# Altium schematic sheet Program_Counter.SchDoc
size B; Author: E. Sims; Organization: Let's Build Rockets Inc.; SheetNumber: 2; SheetTotal: 3
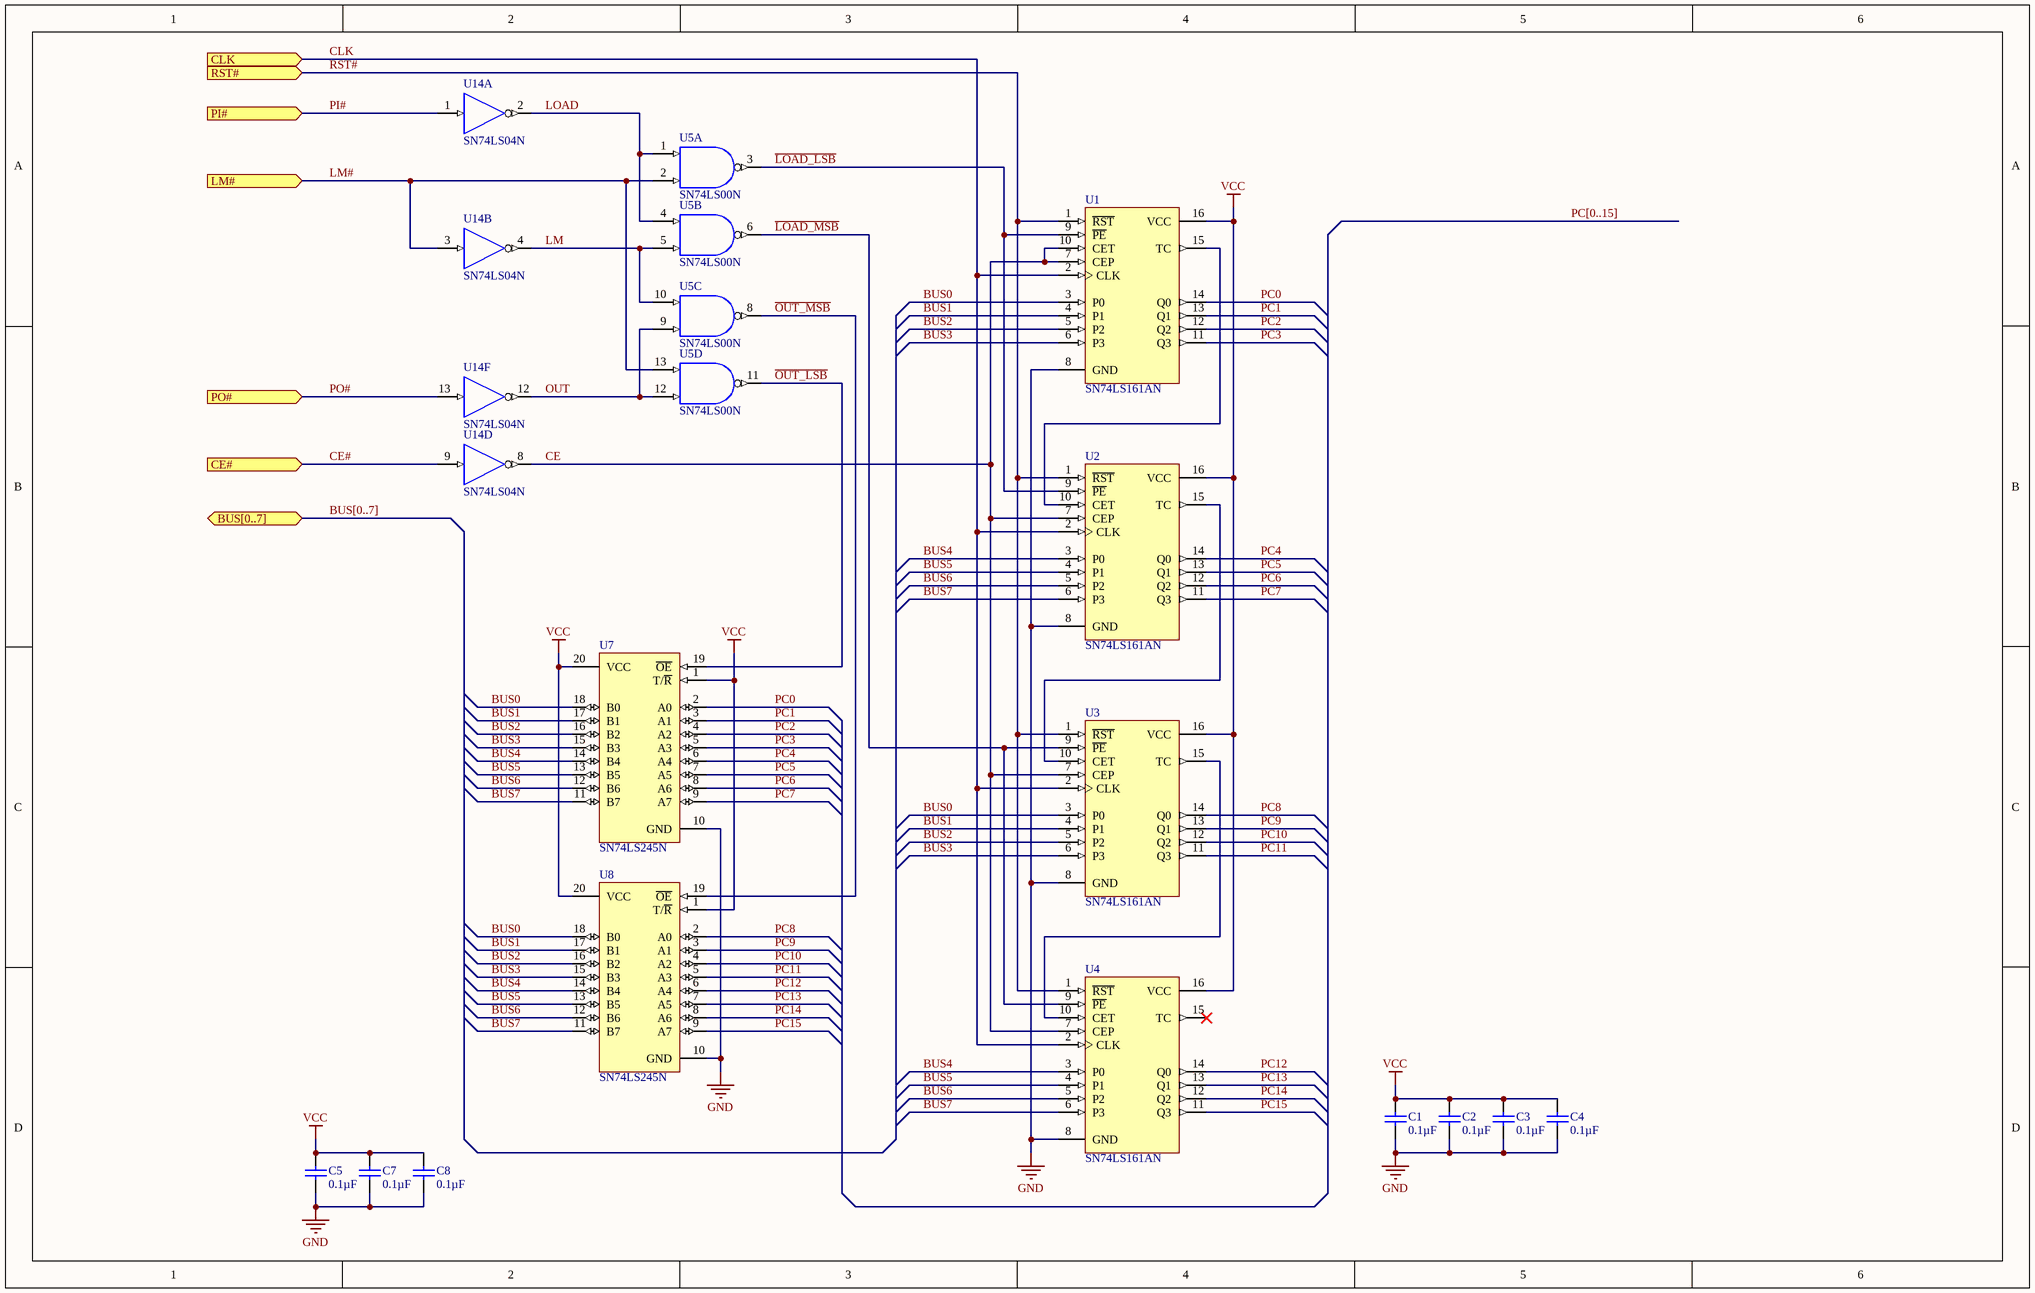
[diagram p0: Program_Counter.SchDoc]

## Parts
C1  Capacitance: 0.1µF  [VISH-K104K15X7RF5TL2]  (hidden comment: K104K15X7RF5TL2)
C2  Capacitance: 0.1µF  [VISH-K104K15X7RF5TL2]  (hidden comment: K104K15X7RF5TL2)
C3  Capacitance: 0.1µF  [VISH-K104K15X7RF5TL2]  (hidden comment: K104K15X7RF5TL2)
C4  Capacitance: 0.1µF  [VISH-K104K15X7RF5TL2]  (hidden comment: K104K15X7RF5TL2)
C5  Capacitance: 0.1µF  [VISH-K104K15X7RF5TL2]  (hidden comment: K104K15X7RF5TL2)
C7  Capacitance: 0.1µF  [VISH-K104K15X7RF5TL2]  (hidden comment: K104K15X7RF5TL2)
C8  Capacitance: 0.1µF  [VISH-K104K15X7RF5TL2]  (hidden comment: K104K15X7RF5TL2)
U1  SN74LS161AN  [N016]
U2  SN74LS161AN  [N016]
U3  SN74LS161AN  [N016]
U4  SN74LS161AN  [N016]
U5  SN74LS00N  [N014]  (parts A,B,C,D of 4)
U7  SN74LS245N  [N020]
U8  SN74LS245N  [N020]
U14  SN74LS04N  [N014]  (parts A,B,D,F of 6)

## Ports
BUS[0..7] (bidir), CE# (in), CLK (in), LM# (in), PI# (in), PO# (in), RST# (in)

## Nets
GND: C1.2 C2.2 C3.2 C4.2 C5.2 C7.2 C8.2 U1.8(GND) U2.8(GND) U3.8(GND) U4.8(GND) U5.7(GND) U7.10(GND) U8.10(GND) U14.7(GND)
VCC: C1.1 C2.1 C3.1 C4.1 C5.1 C7.1 C8.1 U1.16(VCC) U2.16(VCC) U3.16(VCC) U4.16(VCC) U5.14(VCC) U7.1(T/~{R}) U7.20(VCC) U8.1(T/~{R}) U8.20(VCC) U14.14(VCC)
BUS0: U1.3(P0) U3.3(P0) U7.18(B0) U8.18(B0)
BUS1: U1.4(P1) U3.4(P1) U7.17(B1) U8.17(B1)
BUS2: U1.5(P2) U3.5(P2) U7.16(B2) U8.16(B2)
BUS3: U1.6(P3) U3.6(P3) U7.15(B3) U8.15(B3)
BUS4: U2.3(P0) U4.3(P0) U7.14(B4) U8.14(B4)
BUS5: U2.4(P1) U4.4(P1) U7.13(B5) U8.13(B5)
BUS6: U2.5(P2) U4.5(P2) U7.12(B6) U8.12(B6)
BUS7: U2.6(P3) U4.6(P3) U7.11(B7) U8.11(B7)
CE: U1.7(CEP) U1.10(CET) U2.7(CEP) U3.7(CEP) U4.7(CEP) U14.8(Y)
CE#: U14.9(A) ; port CE#
CLK: U1.2(CLK) U2.2(CLK) U3.2(CLK) U4.2(CLK) ; port CLK
~{LOAD_LSB}: U1.9(~{PE}) U2.9(~{PE}) U5.3(Y)
~{LOAD_MSB}: U3.9(~{PE}) U4.9(~{PE}) U5.6(Y)
LM: U5.5(B) U5.10(B) U14.4(Y)
LM#: U5.2(B) U5.13(B) U14.3(A) ; port LM#
LOAD: U5.1(A) U5.4(A) U14.2(Y)
~{OUT_LSB}: U5.11(Y) U7.19(~{OE})
~{OUT_MSB}: U5.8(Y) U8.19(~{OE})
OUT: U5.9(A) U5.12(A) U14.12(Y)
PC0: U1.14(Q0) U7.2(A0)
PC1: U1.13(Q1) U7.3(A1)
PC2: U1.12(Q2) U7.4(A2)
PC3: U1.11(Q3) U7.5(A3)
PC4: U2.14(Q0) U7.6(A4)
PC5: U2.13(Q1) U7.7(A5)
PC6: U2.12(Q2) U7.8(A6)
PC7: U2.11(Q3) U7.9(A7)
PC8: U3.14(Q0) U8.2(A0)
PC9: U3.13(Q1) U8.3(A1)
PC10: U3.12(Q2) U8.4(A2)
PC11: U3.11(Q3) U8.5(A3)
PC12: U4.14(Q0) U8.6(A4)
PC13: U4.13(Q1) U8.7(A5)
PC14: U4.12(Q2) U8.8(A6)
PC15: U4.11(Q3) U8.9(A7)
PI#: U14.1(A) ; port PI#
PO#: U14.13(A) ; port PO#
RST#: U1.1(~{RST}) U2.1(~{RST}) U3.1(~{RST}) U4.1(~{RST}) ; port RST#
NetU1_15: U1.15(TC) U2.10(CET)
NetU2_15: U2.15(TC) U3.10(CET)
NetU3_15: U3.15(TC) U4.10(CET)

Not connected (* = marked no-connect by the designer): U4 15(TC)*

## Buses and harness runs
bus BUS[0..7] = port BUS[0..7]
bus PC[0..15]

## Notes on the sheet
- Let's Build Rocket's Inc. Modular Paylaod System Based on TMP-010 Rev
  For more information visit https://github.com/LetsBuildRockets/Modular-Payload-System
  This work is licensed under CC BY-NC 4.0. To view a copy of this license, visit https://creativecommons.org/licenses/by-nc/4.0
- Title
- Size:
- Date:
- Assembly Variant:
- B
- Number:
- Time:
- Revision:
- Sheet
- of
- Author:
- File:

## Library data of the parts
C1-C5 C7 C8 = CMP-2000-06508-1: Ceramic Capacitor, 100 nF, +/- 10%, 50 V, -55 to 125 degC, 2-Pin THD, RoHS, Tape and Reel; Manufacturer: Vishay; Other Names: BC1084CT; Catalog Drawings: Mono-KapSide2-15_5.58Mono-KapSide1_15; Temperature Coefficient: X7R; Voltage - Rated: 50V; Online Catalog: Mono-Kap™Series; Size / Dimension: 0.157"Lx0.098"W(4.00mmx2.50mm); Operating Temperature: -55°C~125°C; Family: CeramicCapacitors; Manufacturer URL: http://www.vishay.com/; Standard Package: 1; Thickness (Max): -; Ratings: -; Datasheet Version: 08/2013; Package Description: 2-Pin Through Hole Device, Body 4 x 2.6 mm; Mounting Type: ThroughHole; Features: -; Lead Spacing: 0.098"(2.50mm); Tolerance: ±10%; Category: Capacitors; Mounting Technology: ThroughHole; Lead Style: Straight; Datasheet URL: http://www.vishay.com/docs/45171/kseries.pdf; Applications: GeneralPurpose; Package / Case: Radial; Height - Seated (Max): 0.220"(5.58mm); Package Reference: K104K15X7RF5TL2; Series: Mono-Kap™K; Packaging: CutTape(CT)
U1-U4 = SN74LS161AN: Synchronous 4-Bit Counter; Published: 8-Jun-2000; LatestRevisionDate: 04-Mar-2005; LatestRevisionNote: Stylized 3D Model Added.; DatasheetVersion: Mar-1988; PackageVersion: Oct-1995; PackageReference: N016; Publisher: Altium Limited; PackageDescription: DIP; 16 Leads; Row Spacing 7.62 mm; Pitch 2.54 mm; Code_JEDEC: MS-001-BB; ComponentLink1Description: Manufacturer Link; ComponentLink1URL: http://www.ti.com/; ComponentLink2Description: Datasheet; ComponentLink2URL: http://www-s.ti.com/sc/ds/sn74ls161a.pdf; ComponentLink3Description: URL Link1; ComponentLink3URL: http://focus.ti.com/docs/prod/folders/print/sn74ls161a.html
U5 = SN74LS00N: Quadruple 2-Input Positive-NAND Gate; Published: 8-Jun-2000; LatestRevisionDate: 04-Mar-2005; LatestRevisionNote: Stylized 3D Model Added.; DatasheetVersion: Mar-1988; PackageVersion: Oct-1995; PackageReference: N014; Publisher: Altium Limited; PackageDescription: DIP; 14 Leads; Row Spacing 7.62 mm; Pitch 2.54 mm; ComponentLink1Description: Manufacturer Link; ComponentLink1URL: http://www.ti.com/; ComponentLink2Description: Datasheet; ComponentLink2URL: http://www-s.ti.com/sc/ds/sn74ls00.pdf
U7 U8 = SN74LS245N: Octal Bus Transceiver with 3-State Outputs; Published: 8-Jun-2000; LatestRevisionDate: 04-Mar-2005; LatestRevisionNote: Stylized 3D Model Added.; DatasheetVersion: Mar-1988; PackageVersion: Oct-1995; PackageReference: N020; Publisher: Altium Limited; PackageDescription: DIP; 20 Leads; Row Spacing 7.62 mm; Pitch 2.54 mm; ComponentLink1Description: Manufacturer Link; ComponentLink1URL: http://www.ti.com/; ComponentLink2Description: Datasheet; ComponentLink2URL: http://www-s.ti.com/sc/ds/sn74ls245.pdf
U14 = SN74LS04N: Hex Inverter; Published: 8-Jun-2000; LatestRevisionDate: 04-Mar-2005; LatestRevisionNote: Stylized 3D Model Added.; DatasheetVersion: Mar-1988; PackageVersion: Oct-1995; PackageReference: N014; Publisher: Altium Limited; PackageDescription: DIP; 14 Leads; Row Spacing 7.62 mm; Pitch 2.54 mm; ComponentLink1Description: Manufacturer Link; ComponentLink1URL: http://www.ti.com/; ComponentLink2Description: Datasheet; ComponentLink2URL: http://www-s.ti.com/sc/ds/sn74ls04.pdf